# Altium schematic sheet Sheet4.SchDoc
size A
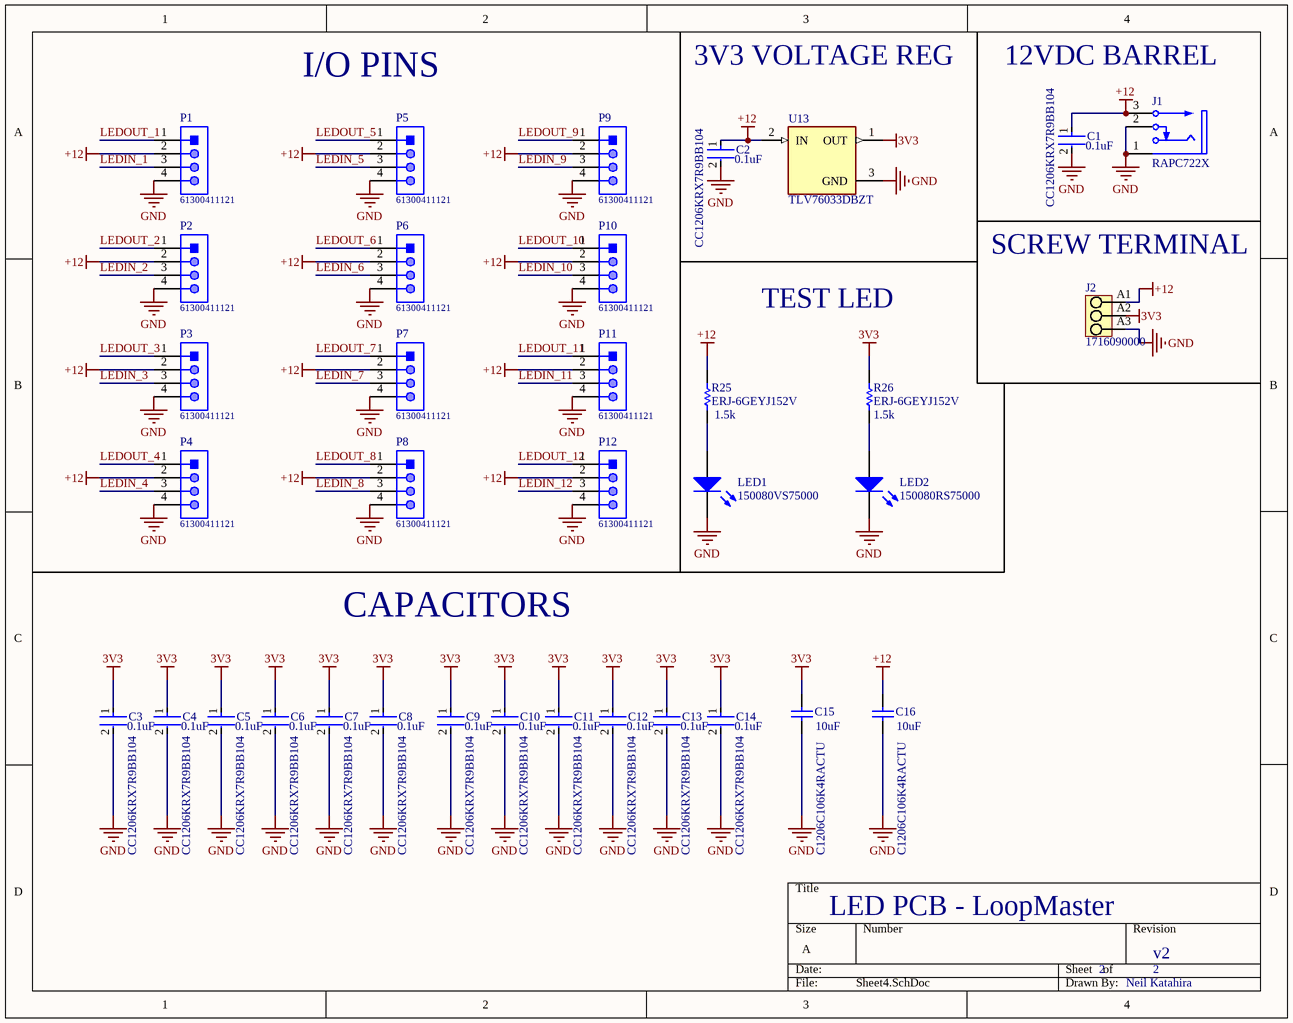
[diagram p0: Sheet4.SchDoc]

## Parts
C1  CC1206KRX7R9BB104  [FP-CC1206-1_25-MFG]
C2  CC1206KRX7R9BB104  [FP-CC1206-1_25-MFG]
C3  CC1206KRX7R9BB104  [FP-CC1206-1_25-MFG]
C4  CC1206KRX7R9BB104  [FP-CC1206-1_25-MFG]
C5  CC1206KRX7R9BB104  [FP-CC1206-1_25-MFG]
C6  CC1206KRX7R9BB104  [FP-CC1206-1_25-MFG]
C7  CC1206KRX7R9BB104  [FP-CC1206-1_25-MFG]
C8  CC1206KRX7R9BB104  [FP-CC1206-1_25-MFG]
C9  CC1206KRX7R9BB104  [FP-CC1206-1_25-MFG]
C10  CC1206KRX7R9BB104  [FP-CC1206-1_25-MFG]
C11  CC1206KRX7R9BB104  [FP-CC1206-1_25-MFG]
C12  CC1206KRX7R9BB104  [FP-CC1206-1_25-MFG]
C13  CC1206KRX7R9BB104  [FP-CC1206-1_25-MFG]
C14  CC1206KRX7R9BB104  [FP-CC1206-1_25-MFG]
C15  C1206C106K4RACTU  [CAPC3216X180X50ML20T25]
C16  C1206C106K4RACTU  [CAPC3216X180X50ML20T25]
J1  RAPC722X  [SWITCH-RAPC712X-3_V]
J2  1716090000  [LM_5_08_90_03]
LED1  150080VS75000  [0805_A]
LED2  150080RS75000  [0805_A]
P1  61300411121  [61300411121]
P2  61300411121  [61300411121]
P3  61300411121  [61300411121]
P4  61300411121  [61300411121]
P5  61300411121  [61300411121]
P6  61300411121  [61300411121]
P7  61300411121  [61300411121]
P8  61300411121  [61300411121]
P9  61300411121  [61300411121]
P10  61300411121  [61300411121]
P11  61300411121  [61300411121]
P12  61300411121  [61300411121]
R25  ERJ-6GEYJ152V  [RESC2013X70X40NL20T20]
R26  ERJ-6GEYJ152V  [RESC2013X70X40NL20T20]
U13  TLV76033DBZT  [FP-DBZ0003A-MFG]

## Nets
3V3: C3.1 C4.1 C5.1 C6.1 C7.1 C8.1 C9.1 C10.1 C11.1 C12.1 C13.1 C14.1 C15.2 J2.A2 R26.2 U13.1(OUT)
+12: C1.1 C2.1 C16.2 J1.3 J2.A1 P1.2 P2.2 P3.2 P4.2 P5.2 P6.2 P7.2 P8.2 P9.2 P10.2 P11.2 P12.2 R25.2 U13.2(IN)
GND: C1.2 C2.2 C3.2 C4.2 C5.2 C6.2 C7.2 C8.2 C9.2 C10.2 C11.2 C12.2 C13.2 C14.2 C15.1 C16.1 J1.1 J1.2 J2.A3 LED1.1(K) LED2.1(K) P1.4 P2.4 P3.4 P4.4 P5.4 P6.4 P7.4 P8.4 P9.4 P10.4 P11.4 P12.4 U13.3(GND)
LEDIN_1: P1.3
LEDIN_2: P2.3
LEDIN_3: P3.3
LEDIN_4: P4.3
LEDIN_5: P5.3
LEDIN_6: P6.3
LEDIN_7: P7.3
LEDIN_8: P8.3
LEDIN_9: P9.3
LEDIN_10: P10.3
LEDIN_11: P11.3
LEDIN_12: P12.3
LEDOUT_1: P1.1
LEDOUT_2: P2.1
LEDOUT_3: P3.1
LEDOUT_4: P4.1
LEDOUT_5: P5.1
LEDOUT_6: P6.1
LEDOUT_7: P7.1
LEDOUT_8: P8.1
LEDOUT_9: P9.1
LEDOUT_10: P10.1
LEDOUT_11: P11.1
LEDOUT_12: P12.1
NetLED1_2: LED1.2(A) R25.1
NetLED2_2: LED2.2(A) R26.1

## Notes on the sheet
- I/O PINS
- 3V3 VOLTAGE REG
- 12VDC BARREL
- 0.1uF
- (near C1) 0.1uF
- (near J2) SCREW TERMINAL
- TEST LED
- (near R25) 1.5k
- (near R26) 1.5k
- CAPACITORS
- (near C14) 0.1uF
- (near C15) 10uF
- (near C16) 10uF
- LED PCB - LoopMaster
- 2
- v2
- Neil Katahira

## Library data of the parts
C1-C14 = CMP-03422-000842-1: CAP CER 0.1UF 50V X7R 1206; Manufacturer: Yageo; Automotive Grade: NA; Value: 100 nF; Tolerance: 0.1; Material: Ceramic; Temperature Coefficient: 15%; Temperature Characteristic: X7R; Device Class L1: Passive Components; Lead Free: Yes; Octopart: https://octopart.com/cc1206krx7r9bb104-yageo-39467816; Category: Cap; Temperature Range Low: -55°C; Device Class L3: Ceramic Capacitors; Voltage Rating: 50 V; Temperature Range High: +125°C; Device Class L2: Capacitors; RoHS: TRUE; Package: CC1206-1.25; Footprint Url: http://www.yageo.com/exep/pages/download/literatures/UPY-C_GEN_24.pdf; ComponentLink2Description: Datasheet; Temperature: -55°C to +125°C; Capacitance: 100 nF; Digikey Description: CAP CER 0.1UF 50V X7R 1206; Height: 1.45mm; Automotive: No; Mouser Description: Multilayer Ceramic Capacitors MLCC - SMD/SMT 100nF 50V X7R 10%; ComponentLink2URL: http://www.yageo.com/documents/recent/UPY-NP0X7R_HV_1KV-to-3KV_11.pdf; Manufacturer Part Number: CC1206KRX7R9BB104
C15 C16 = CMP-1664-00006-1: CAP, Ceramic, 10 uF, +/- 10%, 16 V, -55 to 125 degC, 1206 (3216 Metric), RoHS, Tape and Reel; Voltage Rating: 50 V; Case\Package: 0603; Type (Capacitors): C0G; Tolerance: 5%; Capacitance: 8.2 pF; Length: 1.6 mm; Mount: Surface Mount; Radiation Hardening: No; Height: 0.8 mm; RoHSCompliant: true; ComponentLink1URL: http://www.kemet.com/; REACH SVHC: No SVHC; ComponentLink1Description: Manufacturer URL; ComponentLink2Description: Datasheet; ComponentLink2URL: http://capacitoredge.kemet.com/capedge2/DataSheet/Datasheet-C1206C106K4RACTU.pdf?pn=C1206C106K4RACTU; Width: 0.8 mm; Packaging: Tape and Reel; Min Operating Temperature: -55 degC; Voltage Rating (DC): 50 V; Pins: 2; Max Operating Temperature: 125 degC; Case Code (Imperial): 0603; PackageDescription: 2-Pin Surface Mount Device, Body 3.2 x 1.6 mm; DatasheetVersion: Aug-16; Package Quantity: 4000; PackageReference: 1206; Case Code (Metric): 1608
J1 = CMP-2000-05384-1: Power Jack, 5 A, 3-Pin THD, RoHS, Bulk; Manufacturer: Switchcraft; Current Rating: 5A; Plug/Mating Plug Diameter: 2.1mmID,5.5mmOD; Gender: Male; Mating Products: S765-ND / -CONNPLUGMINIPWR2CONDWHT/RED / S760K-ND / -CONNPOWERPLUGMINI.08"BLACK / SC1052-ND / -CONNPOWERPLUGMINIBLACK; Number of Positions/Contacts: 2Conductors,2Contacts; Internal Switch(s): SingleSwitch,NormallyClosed; Shielding: Unshielded; Catalog Drawings: RAPC7(1,2)2XSide / RAPC7(1,2)2XTop; Dynamic Catalog: SwitchcraftInc; Other Names: Q2287470A / RAPC722X-ND / SC1313; Standard Package: 2,500; Termination: SolderEyelet(s); Family: Barrel-PowerConnectors; Housing Color: Black; Housing Material: Thermoplastic; RoHS Information: SwitchcraftRoHSInfo; Color: Black; Contact Material - Plating: Nickel; Mounting Type: ThroughHole,RightAngle; Manufacturer URL: http://www.switchcraft.com/; Contact Material: Brass; Datasheet Version: Rev. A, 08/2005; Connector Type: Jack; Category: Connectors,Interconnects; Datasheet URL: http://www.mouser.com/ds/2/393/rapc722x_cd-371352.pdf
J2 = CMP-1559-01768-1: OMNIMATE Signal - series LM; Manufacturer: Weidmueller; Contact_surface: tinned; Pitch_mm: 5,08 mm; Solder_pin_length_mm: 3,5 mm; Contact_material: Cu-Leg; Wire_cross_section_AWG_min_UL_1059: AWG 24; Solid_min_H05_07_V_U: 0,2 mm²; Insulating_material: Wemid (PA); Solid_max_H05_07_V_U: 2,5 mm²; Pitch_inch: 0,2 inch; Wire_cross_section_AWG_max_UL_1059: AWG 14; UL_94_flammability_rating: V-0; No_of_poles: 3; Rated_voltage_use_group_B_UL_1059: 300 V; Mounting_onto_the_PCB: Solder connection; Side_termination_characteristic: closed side; Short_text_for_material: LM 5.08/03/90 3.5SN OR BX; Rated_current_use_group_B_UL_1059: 15 A; Rated_voltage_for_surge_voltage_class_pollution_degree_II_2: 630 V; Revision: V1; ComponentLink2URL: http://catalog.weidmueller.com/catalog/Start.do?localeId=en&ObjectID=1716090000; Colour: Orange; PackageReference: LM_5_08_90_03; ComponentLink1Description: Manufacturer URL; ComponentLink2Description: URL Link1; ComponentLink1URL: http://www.weidmueller.com/; Qty: 500 PCS; PartNumber: 1716090000; Packaging: Box
LED1 = CMP-1426-00009-1: SMD mono-color Chip LED, WL-SMCW, Bright Green; Manufacturer: Wuerth Elektronik; ComponentLink1Description: Manufacturer URL; Color: Bright Green; PackageReference: 0805_A; PartNumber: 150080VS75000; ComponentLink1URL: http://www.we-online.com; ComponentLink2Description: Datasheet; ComponentLink2URL: http://katalog.we-online.com/led/datasheet/150080VS75000.pdf
LED2 = CMP-1426-00011-1: SMD mono-color Chip LED, WL-SMCW, Red; Manufacturer: Wuerth Elektronik; Color: Red; PartNumber: 150080RS75000; PackageReference: 0805_A; ComponentLink2Description: Datasheet; ComponentLink1URL: http://www.we-online.com; ComponentLink1Description: Manufacturer URL; ComponentLink2URL: http://katalog.we-online.com/led/datasheet/150080RS75000.pdf
P1-P12 = CMP-1502-01064-1: THT Vertical Pin Header WR-PHD, Pitch 2.54 mm, Single Row, 4 pins; Manufacturer: Wurth Elektronik; Withstanding Voltage: 500VAC; Rated Current: 3A; Working Voltage: 250VAC; Pin Number: 4; Gender: Male; Contact Resistance: 20mOhm; Pitch: 2.54mm; Manufacturer URL: http://www.we-online.de; Operating Temperature: -40to105degC; Packaging: Bag; Mounting Technology: THT; Package Reference: 61300411121; Datasheet URL: https://katalog.we-online.de/em/datasheet/6130xx11121.pdf; Publisher: WurthElektronik; Part Number: 61300411121; Row Number: Single; Orientation: Vertical
R25 R26 = CMP-2001-00355-1: Manufacturer: Panasonic; Part Number: ERJ-6GEYJ152V
U13 = CMP-04917-000033-1: IC REG LINEAR 3.3V 100MA SOT23-3; Manufacturer: Texas Instruments; Max Supply Voltage: 30V; Standoff Height: 0.01mm; Accuracy Percentage: 4%; Nominal Supply Current: 2mA; Output Type: Fixed; Min Supply Voltage: 4.2V; Dropout Voltage: 0.9V; Number Of Outputs: 1; Max Junction Temp: +125°C; RoHS: TRUE; ComponentLink2Description: Datasheet; Manufacturer Part Number: TLV76033DBZT; Device Class L2: Power Management ICs; Temperature Range High: +125°C; Height: 1.12mm; Ipc Land Pattern Name: SOT95P237X112-3; Device Class L1: Integrated Circuits (ICs); Package: DBZ0003A; Output Voltage: 3.3V; Temperature: -40°C to +125°C; Device Class L3: Voltage Regulators - Linear; Lead Free: Yes; Output Current: 100mA; Temperature Range Low: -40°C; Digikey Description: IC REG LINEAR 3.3V 100MA SOT23-3; Automotive: No; Category: IC; ComponentLink2URL: http://www.ti.com/lit/ds/symlink/tlv760.pdf; Octopart: https://octopart.com/tlv76033dbzt-texas+instruments-84619834